# Altium project DSO.PrjPCB
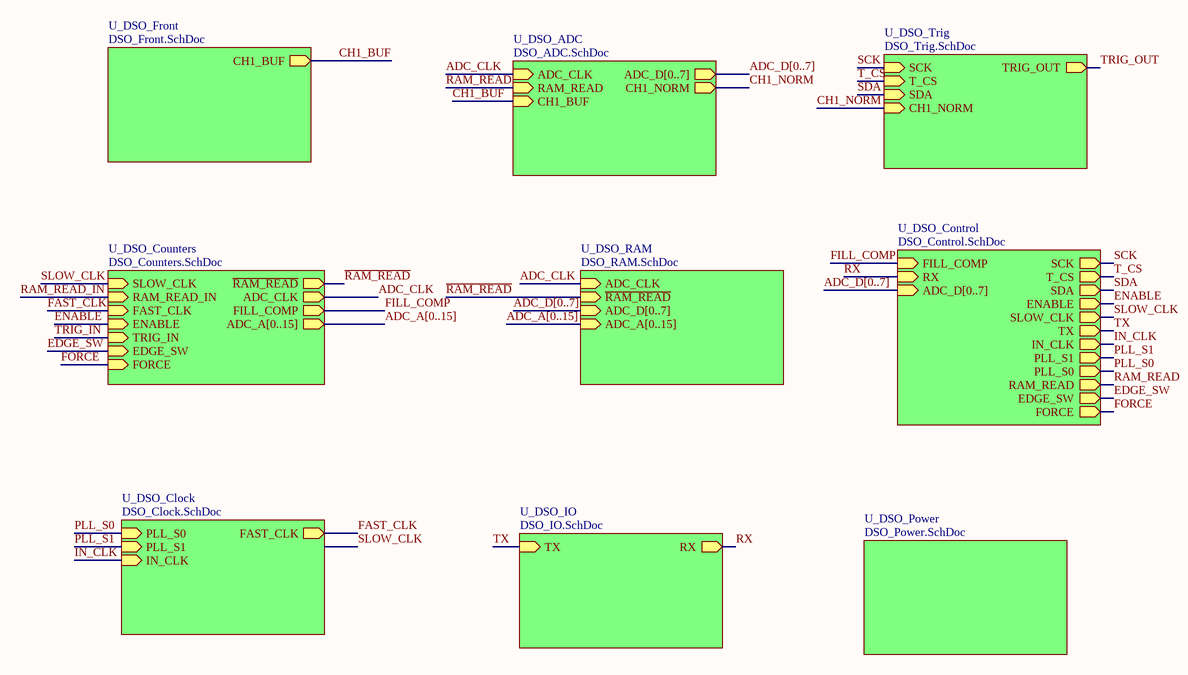
[diagram p0: DSO_Top.SchDoc]
11 sheets, 95 parts. Net scope: hierarchical (ports join the sheet entries above them; power ports are global).
Sheets:
  DSO_Top.SchDoc
    U_DSO_ADC = DSO_ADC.SchDoc
    U_DSO_Clock = DSO_Clock.SchDoc
    U_DSO_Control = DSO_Control.SchDoc
    U_DSO_Counters = DSO_Counters.SchDoc
      U_DSO_CPLD = DSO_CPLD.SchDoc
    U_DSO_Front = DSO_Front.SchDoc
    U_DSO_IO = DSO_IO.SchDoc
    U_DSO_Power = DSO_Power.SchDoc
    U_DSO_RAM = DSO_RAM.SchDoc
    U_DSO_Trig = DSO_Trig.SchDoc

## Sheet DSO_Top.SchDoc: Schematic_Name
size A4; CompanyName: University of Melbourne; Engineer: Your Name Here; DocumentNumber: 1; Revision: 0.1; SheetNumber: 1; SheetTotal: 1; Title_Project: Project_Title; StudentNo: Student No.

### Sub-sheets
U_DSO_ADC = DSO_ADC.SchDoc: ADC_CLK (in), ADC_D[0..7] (out), RAM_READ (in), CH1_BUF (in), CH1_NORM (out)
U_DSO_Clock = DSO_Clock.SchDoc: FAST_CLK (out), PLL_S0 (in), PLL_S1 (in), IN_CLK (in)
U_DSO_Control = DSO_Control.SchDoc: SCK (out), T_CS (out), SDA (out), ENABLE (out), FILL_COMP (in), SLOW_CLK (out), TX (out), RX (in), IN_CLK (out), PLL_S1 (out), PLL_S0 (out), RAM_READ (out), ADC_D[0..7] (in), EDGE_SW (out), FORCE (out)
U_DSO_Counters = DSO_Counters.SchDoc: SLOW_CLK (in), ~{RAM_READ} (out), ADC_CLK (out), RAM_READ_IN (in), FAST_CLK (in), FILL_COMP (out), ENABLE (in), TRIG_IN (in), EDGE_SW (in), FORCE (in), ADC_A[0..15] (out)
U_DSO_Front = DSO_Front.SchDoc: CH1_BUF (out)
U_DSO_IO = DSO_IO.SchDoc: TX (in), RX (out)
U_DSO_Power = DSO_Power.SchDoc: no entries
U_DSO_RAM = DSO_RAM.SchDoc: ADC_CLK (in), ~{RAM_READ} (in), ADC_D[0..7] (in), ADC_A[0..15] (in)
U_DSO_Trig = DSO_Trig.SchDoc: TRIG_OUT (out), SCK (in), T_CS (in), SDA (in), CH1_NORM (in)

### Nets
ADC_CLK: sheet U_DSO_ADC/ADC_CLK, sheet U_DSO_Counters/ADC_CLK, sheet U_DSO_RAM/ADC_CLK
CH1_BUF: sheet U_DSO_ADC/CH1_BUF, sheet U_DSO_Front/CH1_BUF
CH1_NORM: sheet U_DSO_ADC/CH1_NORM, sheet U_DSO_Trig/CH1_NORM
EDGE_SW: sheet U_DSO_Control/EDGE_SW, sheet U_DSO_Counters/EDGE_SW
ENABLE: sheet U_DSO_Control/ENABLE, sheet U_DSO_Counters/ENABLE
FAST_CLK: sheet U_DSO_Clock/FAST_CLK, sheet U_DSO_Counters/FAST_CLK
FILL_COMP: sheet U_DSO_Control/FILL_COMP, sheet U_DSO_Counters/FILL_COMP
FORCE: sheet U_DSO_Control/FORCE, sheet U_DSO_Counters/FORCE
IN_CLK: sheet U_DSO_Clock/IN_CLK, sheet U_DSO_Control/IN_CLK
PLL_S0: sheet U_DSO_Clock/PLL_S0, sheet U_DSO_Control/PLL_S0  [project net Clk_S0]
PLL_S1: sheet U_DSO_Clock/PLL_S1, sheet U_DSO_Control/PLL_S1  [project net Clk_S1]
~{RAM_READ}: sheet U_DSO_Counters/~{RAM_READ}, sheet U_DSO_RAM/~{RAM_READ}
RAM_READ: sheet U_DSO_ADC/RAM_READ, sheet U_DSO_Control/RAM_READ
RX: sheet U_DSO_Control/RX, sheet U_DSO_IO/RX
SCK: sheet U_DSO_Control/SCK, sheet U_DSO_Trig/SCK
SDA: sheet U_DSO_Control/SDA, sheet U_DSO_Trig/SDA
SLOW_CLK: sheet U_DSO_Control/SLOW_CLK, sheet U_DSO_Counters/SLOW_CLK
T_CS: sheet U_DSO_Control/T_CS, sheet U_DSO_Trig/T_CS
TX: sheet U_DSO_Control/TX, sheet U_DSO_IO/TX

### Buses and harness runs
bus ADC_A[0..15] = sheet U_DSO_Counters/ADC_A[0..15]
bus ADC_A[0..15] = sheet U_DSO_RAM/ADC_A[0..15]
bus ADC_D[0..7] = sheet U_DSO_ADC/ADC_D[0..7]
bus ADC_D[0..7] = sheet U_DSO_Control/ADC_D[0..7]
bus ADC_D[0..7] = sheet U_DSO_RAM/ADC_D[0..7]

## Sheet DSO_ADC.SchDoc: Schematic_Name
size A4; CompanyName: University of Melbourne; Engineer: Your Name Here; DocumentNumber: 1; Revision: 0.1; SheetNumber: 1; SheetTotal: 1; Title_Project: Project_Title; StudentNo: Student No.
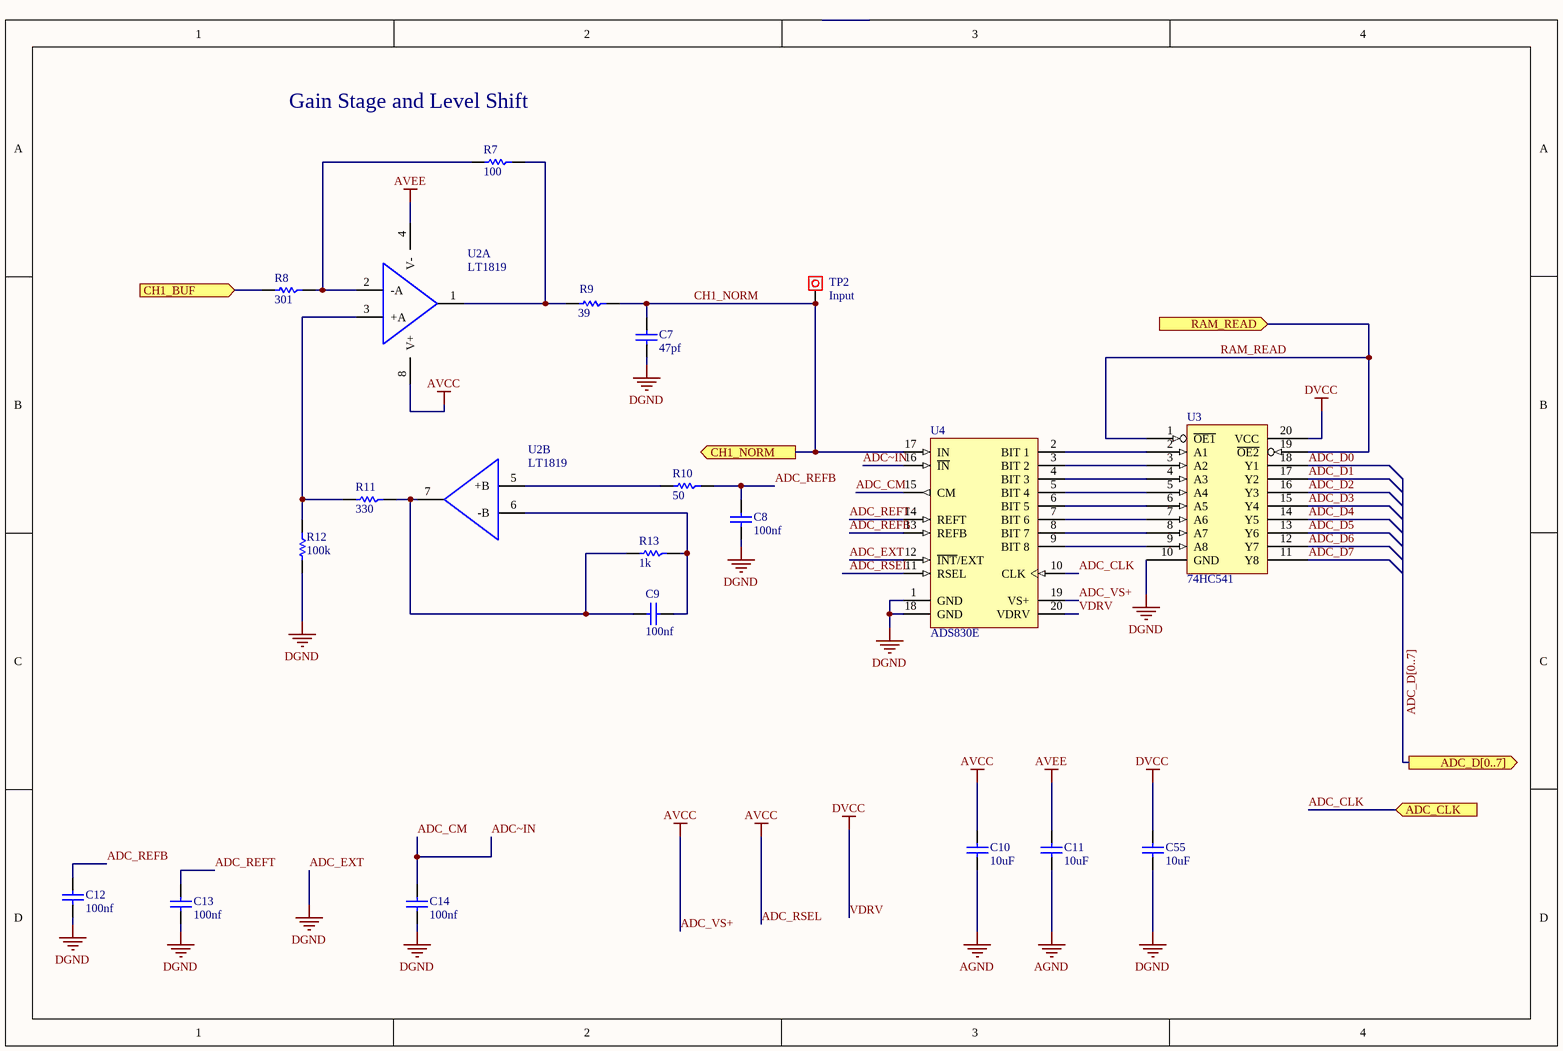
[diagram p1: DSO_ADC.SchDoc]

### Parts
(Parts that share a designator on the sheet are numbered #1, #2 ... from top to bottom, then left to right.)
C7#1  47pf  [0805C]
C8#1  100nf  [0805C]
C9#1  100nf  [0805C]
C10#1  10uF  [0805C]
C11#1  10uF  [0805C]
C12#1  100nf  [0805C]
C13#1  100nf  [0805C]
C14#1  100nf  [0805C]
C55  10uF  [0805C]
R7  100  [0805]
R8  301  [0805]
R9  39  [0805]
R10  50  [0805]
R11  330  [0805]
R12  100k  [0805]
R13  1k  [0805]
TP2  INPUT  [Testpoin]
U2  LT1819  [MSOP-8]  (parts A,B of 2)
U3#1  74HC541  [SOT163-1_N]
U4#1  ADS830E  [TI-DBQ20_L]

### Ports
ADC_CLK (in), ADC_D[0..7] (out), CH1_BUF (in), CH1_NORM (out), RAM_READ (in)

### Nets
ADC_EXT: C7#1.2 C8#1.1 C12#1.1 C13#1.1 C14#1.1 C55.2 R12.2 U3#1.10(GND) U4#1.1(GND) U4#1.12(~{INT}/EXT) U4#1.18(GND)  [also labelled DGND]
ADC_RSEL: C10#1.1 U2.8(V+) U4#1.11(RSEL) U4#1.19(VS+)  [also labelled ADC_VS+, AVCC]
AGND: C10#1.2 C11#1.2
AVEE: C11#1.1 U2.4(V-)
VDRV: C55.1 U3#1.20(VCC) U4#1.20(VDRV)  [also labelled DVCC]
ADC_CLK: U4#1.10(CLK) ; port ADC_CLK
ADC_CM: C14#1.2 U4#1.15(CM) U4#1.16(~{IN})  [also labelled ADC~IN]
ADC_D0: U3#1.18(Y1)
ADC_D1: U3#1.17(Y2)
ADC_D2: U3#1.16(Y3)
ADC_D3: U3#1.15(Y4)
ADC_D4: U3#1.14(Y5)
ADC_D5: U3#1.13(Y6)
ADC_D6: U3#1.12(Y7)
ADC_D7: U3#1.11(Y8)
ADC_REFB: C8#1.2 C12#1.2 R10.1 U4#1.13(REFB)
ADC_REFT: C13#1.2 U4#1.14(REFT)
CH1_BUF: R8.2 ; port CH1_BUF
CH1_NORM: C7#1.1 R9.1 TP2.1 U4#1.17(IN) ; port CH1_NORM
RAM_READ: U3#1.1(~{OE1}) U3#1.19(~{OE2}) ; port RAM_READ
NetC9#1_1: C9#1.1 R11.1 R13.2 U2.7(OUTB)
NetC9#1_2: C9#1.2 R13.1 U2.6(-B)
NetR7_1: R7.1 R9.2 U2.1(OUTA)
NetR7_2: R7.2 R8.1 U2.2(-A)
NetR10_2: R10.2 U2.5(+B)
NetR11_2: R11.2 R12.1 U2.3(+A)
NetU3#1_2: U3#1.2(A1) U4#1.2(BIT_1)
NetU3#1_3: U3#1.3(A2) U4#1.3(BIT_2)
NetU3#1_4: U3#1.4(A3) U4#1.4(BIT_3)
NetU3#1_5: U3#1.5(A4) U4#1.5(BIT_4)
NetU3#1_6: U3#1.6(A5) U4#1.6(BIT_5)
NetU3#1_7: U3#1.7(A6) U4#1.7(BIT_6)
NetU3#1_8: U3#1.8(A7) U4#1.8(BIT_7)
NetU3#1_9: U3#1.9(A8) U4#1.9(BIT_8)

### Buses and harness runs
bus ADC_D[0..7] = port ADC_D[0..7]

### Notes on the sheet
- (near R7) Gain Stage and Level Shift

### Library data of the parts
C7#1 C8#1 C9#1 C10#1 C11#1 C12#1 C13#1 C14#1 C55 = C: Capacitor; Reviewed by: RM - 2018/08/05; Revision: July-2002: Re-released for DXP Platform.; Supplier 1: *; Supplier Part Number 1: *
  C7#1: Value: 47pf
  C8#1 C9#1 C12#1 C13#1 C14#1: Value: 100nf
  C10#1 C11#1 C55: Value: 10uF
R7-R13 = R: Resistor; Reviewed by: RM - 2018/08/05; Supplier 1: *; Suppler Part Number 1: *
  R7: Value: 100
  R8: Value: 301
  R9: Value: 39
  R10: Value: 50
  R11: Value: 330
  R12: Value: 100k
  R13: Value: 1k
TP2 = Test Point: Pad; Value: Input
U2 = LT1819: OpAmp High Frequency Dual; Reviewed by: RM - 2018/08/05; Supplier 1: Digi-Key; Supplier Part Number 1: LT1819CMS8#PBF-ND
U3#1 = 74HC541: (ADV) Octal Buffer, Line Driver; Reviewed by: RM - 2018/08/05; Supplier 1: Digi-Key; Supplier Part Number 1: 296-1202-1-ND
U4#1 = ADS830E: 8-Bit, 60 MSPS ADC Single-Ended / Differential Input, Internal / External Reference and Programmble Input Range, -40 to 85 degC, 20-pin SOP (DBQ20), Green (RoHS & no Sb/Br); Reviewed by: RM - 2018/08/05; ComponentLink2URL: http://www.ti.com/general/docs/lit/getliterature.tsp?genericPartNumber=ADS830&fileType=pdf; ComponentLink2Description: Datasheet; ComponentLink1URL: http://www.ti.com/; ComponentLink3URL: http://www.ti.com/litv/pdf/mpds210a; ComponentLink3Description: Package Specification; ComponentLink1Description: Manufacturer URL; Supplier 1: Digi-Key; Supplier Part Number 1: ADS830E-ND

## Sheet DSO_Clock.SchDoc: Schematic_Name
size A4; CompanyName: University of Melbourne; Engineer: Your Name Here; DocumentNumber: 1; Revision: 0.1; SheetNumber: 1; SheetTotal: 1; Title_Project: Project_Title; StudentNo: Student No.
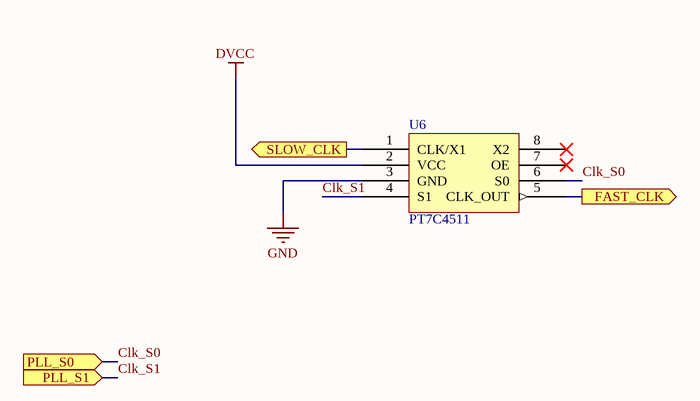
[diagram p2: DSO_Clock.SchDoc]

### Parts
(Parts that share a designator on the sheet are numbered #1, #2 ... from top to bottom, then left to right.)
U6#1  PT7C4511  [SOIC-8]

### Ports
FAST_CLK (out), PLL_S0 (in), PLL_S1 (in), SLOW_CLK (out)

### Nets
DVCC: U6#1.2(VCC)  [project net VDRV]
GND: U6#1.3(GND)
Clk_S0: U6#1.6(S0) ; port PLL_S0
Clk_S1: U6#1.4(S1) ; port PLL_S1
FAST_CLK: U6#1.5(CLK_OUT) ; port FAST_CLK
NetU6#1_1: U6#1.1(CLK/X1) ; port SLOW_CLK

Not connected (* = marked no-connect by the designer): U6#1 7(OE)* 8(X2)*

### Library data of the parts
U6#1 = PT7C4511: PLL Clock Multiplier; Reviewed by: RM - 2018/08/05; Supplier 1: Digi-Key; Supplier Part Number 1: PT7C4511WEXDICT-ND

## Sheet DSO_Control.SchDoc: Schematic_Name
size A4; CompanyName: University of Melbourne; Engineer: Your Name Here; DocumentNumber: 1; Revision: 0.1; SheetNumber: 1; SheetTotal: 1; Title_Project: Project_Title; StudentNo: Student No.
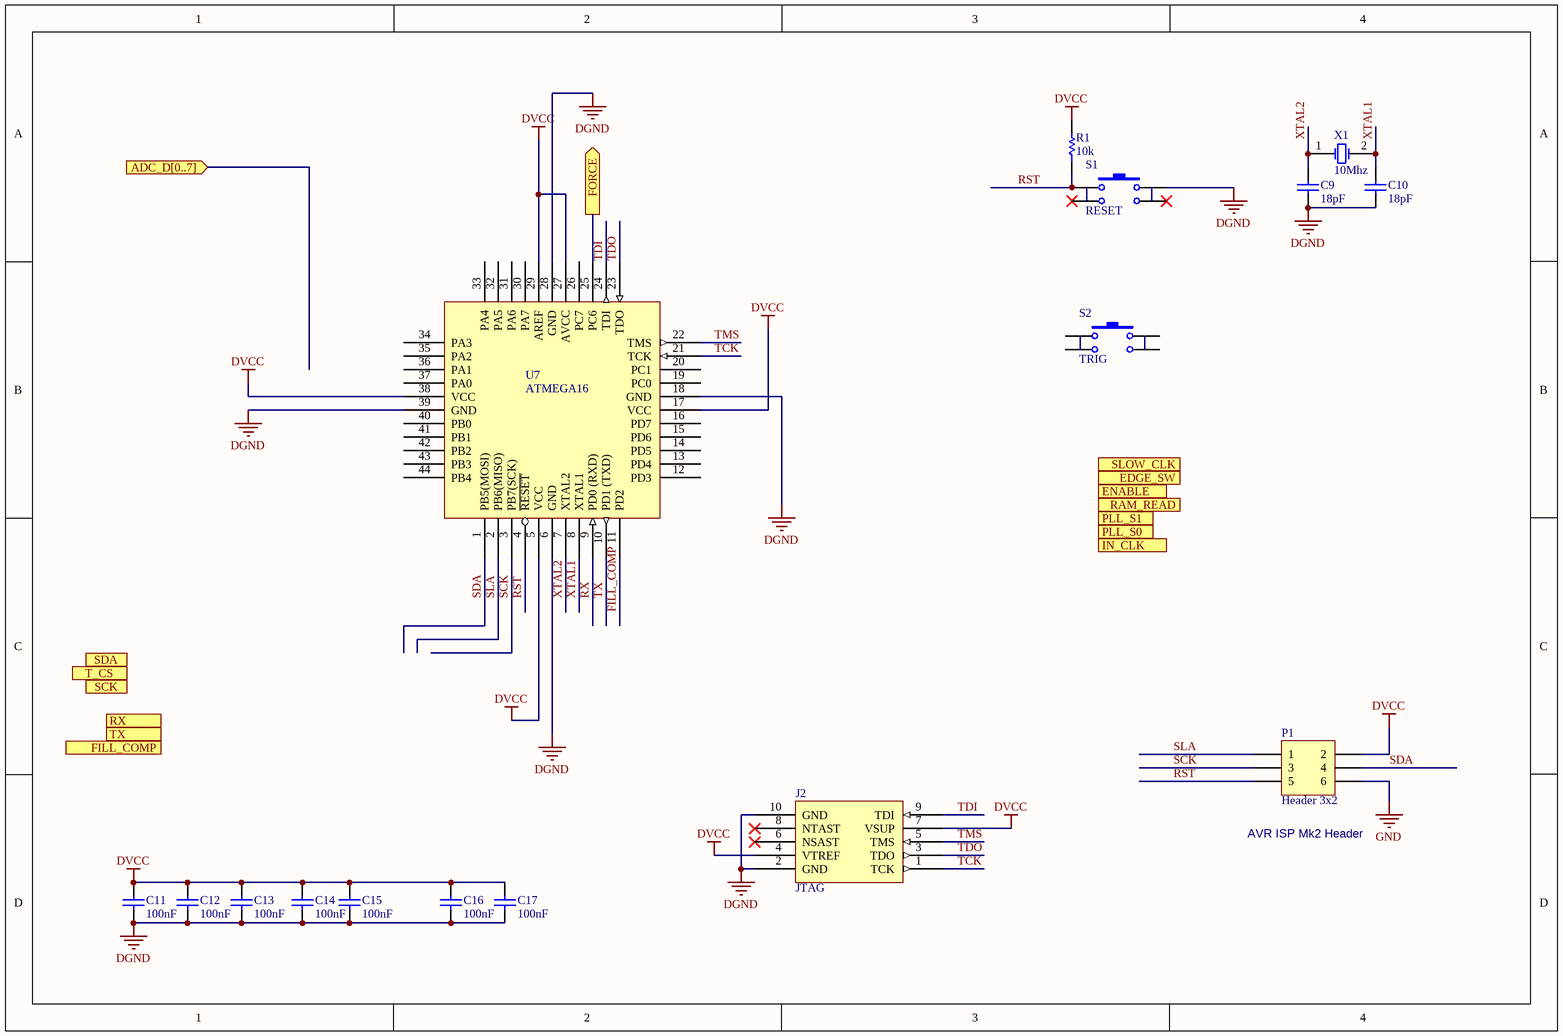
[diagram p3: DSO_Control.SchDoc]

### Parts
(Parts that share a designator on the sheet are numbered #1, #2 ... from top to bottom, then left to right.)
C9#2  18pF  [0805C]
C10#2  18pF  [0805C]
C11#2  100nF  [0805C]
C12#2  100nF  [0805C]
C13#2  100nF  [0805C]
C14#2  100nF  [0805C]
C15#1  100nF  [0805C]
C16#1  100nF  [0805C]
C17#1  100nF  [0805C]
J2  JTAG  [BOXEDVERT10]
P1  Header 3x2  [HDR3x2]
R1#1  10k  [0805]
S1  RESET  [SPST PB SWITCH SMD]
S2  TRIG  [SPST PB SWITCH SMD]
U7  ATMEGA16  [QFP-48]
X1  10Mhz  [XTAL_FLAT_SMD]

### Ports
ADC_D[0..7] (in), EDGE_SW (out), ENABLE (out), FILL_COMP (in), FORCE (out), IN_CLK (out), PLL_S0 (out), PLL_S1 (out), RAM_READ (out), RX (in), SCK (out), SDA (out), SLOW_CLK (out), T_CS (out), TX (out)

### Nets
DGND: C9#2.2 C10#2.2 C11#2.2 C12#2.2 C13#2.2 C14#2.2 C15#1.2 C16#1.2 C17#1.2 J2.2(GND) J2.10(GND) S1.2 U7.6(GND) U7.18(GND) U7.28(GND) U7.39(GND)  [project net ADC_EXT]
DVCC: C11#2.1 C12#2.1 C13#2.1 C14#2.1 C15#1.1 C16#1.1 C17#1.1 J2.4(VTREF) J2.7(VSUP) P1.2 R1#1.2 U7.5(VCC) U7.17(VCC) U7.27(AVCC) U7.29(AREF) U7.38(VCC)  [project net VDRV]
GND: P1.6
FILL_COMP: U7.11(PD2)
FORCE: U7.25(PC6) ; port FORCE
RST: P1.5 R1#1.1 S1.1 U7.4(~{RESET})
RX: U7.9(PD0_(RXD))
SCK: P1.3 U7.3(PB7(SCK))
SDA: P1.4 U7.1(PB5(MOSI))
SLA: P1.1 U7.2(PB6(MISO))
TCK: J2.1(TCK) U7.21(TCK)
TDI: J2.9(TDI) U7.24(TDI)
TDO: J2.3(TDO) U7.23(TDO)
TMS: J2.5(TMS) U7.22(TMS)
TX: U7.10(PD1_(TXD))
XTAL1: C10#2.1 U7.8(XTAL1) X1.2(OSC2)
XTAL2: C9#2.1 U7.7(XTAL2) X1.1(OSC1)

Not connected (* = marked no-connect by the designer): J2 6(NSAST)* 8(NTAST)*; S1 3* 4*; S2 1 2 3 4; U7 12(PD3) 13(PD4) 14(PD5) 15(PD6) 16(PD7) 19(PC0) 20(PC1) 26(PC7) 30(PA7) 31(PA6) 32(PA5) 33(PA4) 34(PA3) 35(PA2) 36(PA1) 37(PA0) 40(PB0) 41(PB1) 42(PB2) 43(PB3) 44(PB4)

### Notes on the sheet
- (near P1) AVR ISP Mk2 Header

### Library data of the parts
C9#2 C10#2 C11#2 C12#2 C13#2 C14#2 C15#1 C16#1 C17#1 = C: Capacitor; Reviewed by: RM - 2018/08/05; Revision: July-2002: Re-released for DXP Platform.; Supplier 1: *; Supplier Part Number 1: *
  C9#2 C10#2: Value: 18pF
  C11#2 C12#2 C13#2 C14#2 C15#1 C16#1 C17#1: Value: 100nF
J2 = JTAG_CON: Reviewed by: RM - 2018/08/05; Supplier 1: Digi-Key; Supplier Part Number 1: OR896-ND
P1 = Header 3x2: Header, 5-Pin; Reviewed by: RM - 2018/08/05; Supplier 1: Digi-Key; Supplier Part Number 1: 952-2121-ND
R1#1 = R: Resistor; Reviewed by: RM - 2018/08/05; Value: 10k; Supplier 1: *; Suppler Part Number 1: *
S1 S2 = SW_PB_1P1T4: Momentary Push Button Switch 1P 1T 2pins; Reviewed by: RM - 2018/08/05; Revision: July-2002: Re-released for DXP Platform.; Supplier 1: Digi-Key; Supplier Part Number 1: CKN9085CT-ND
U7 = ATMEGA16: ATMEGA16 Microcontroller; Reviewed by: RM - 2018/08/05; Supplier 1: Digi-Key; Supplier Part Number 1: ATMEGA16A-AU-ND
X1 = XTAL: Crystal Oscillator; Reviewed by: RM - 2018/08/05; Revision: July-2002: Re-released for DXP Platform.; Supplier 1: Digi-Key; Supplier Part Number 1: 887-1080-1-ND

## Sheet DSO_Counters.SchDoc: Schematic_Name
size A4; CompanyName: University of Melbourne; DrawnBy: Student_#; Engineer: Your Name Here; Organization: University of Melbourne; DocumentNumber: 5; Revision: 0.1; SheetNumber: 5; SheetTotal: 10; Title_Project: Project_Title
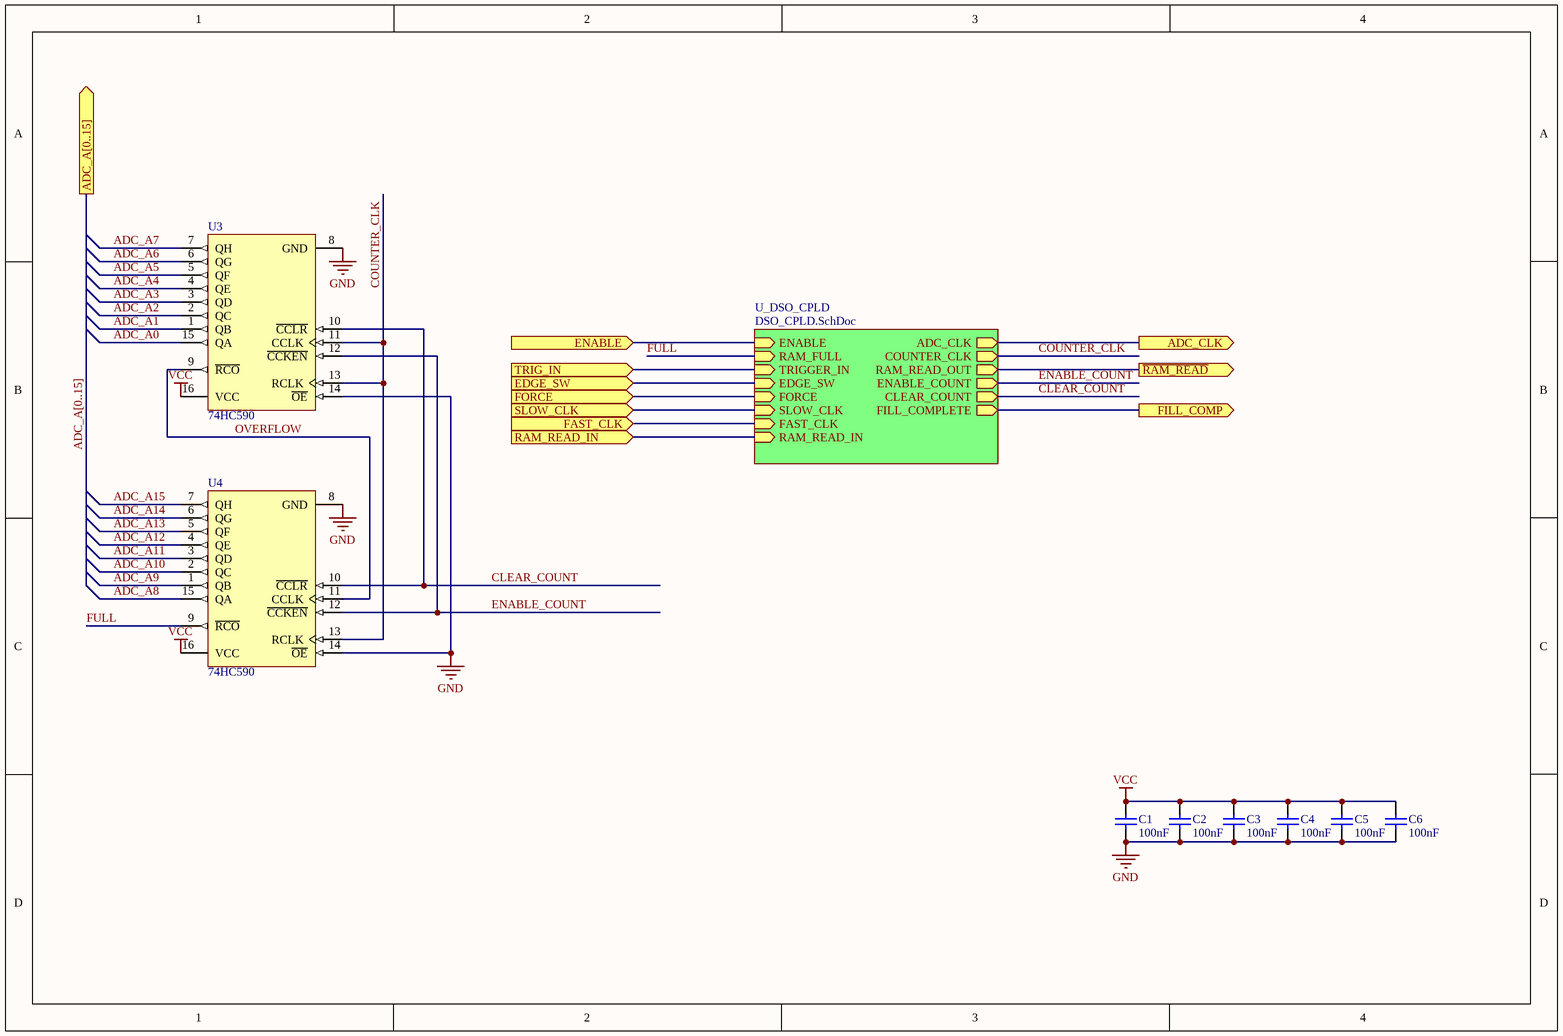
[diagram p4: DSO_Counters.SchDoc]

### Parts
(Parts that share a designator on the sheet are numbered #1, #2 ... from top to bottom, then left to right.)
C1#1  100nF  [0805C]
C2#1  100nF  [0805C]
C3#1  100nF  [0805C]
C4#1  100nF  [0805C]
C5#1  100nF  [0805C]
C6#1  100nF  [0805C]
U3#2  74HC590  [SOIC-16]
U4#2  74HC590  [SOIC-16]

### Sub-sheets
U_DSO_CPLD = DSO_CPLD.SchDoc: ENABLE (in), RAM_FULL (in), TRIGGER_IN (in), EDGE_SW (in), FORCE (in), SLOW_CLK (in), FAST_CLK (in), RAM_READ_IN (in), ADC_CLK (out), COUNTER_CLK (out), RAM_READ_OUT (out), ENABLE_COUNT (out), CLEAR_COUNT (out), FILL_COMPLETE (out)

### Ports
ADC_A[0..15] (out), ADC_CLK (out), EDGE_SW (in), ENABLE (in), FAST_CLK (in), FILL_COMP (out), FORCE (in), RAM_READ_IN (in), SLOW_CLK (in), TRIG_IN (in), ~{RAM_READ} (out)

### Nets
GND: C1#1.2 C2#1.2 C3#1.2 C4#1.2 C5#1.2 C6#1.2 U3#2.8(GND) U3#2.14(~{OE}) U4#2.8(GND) U4#2.14(~{OE})
VCC: C1#1.1 C2#1.1 C3#1.1 C4#1.1 C5#1.1 C6#1.1 U3#2.16(VCC) U4#2.16(VCC)
ADC_A0: U3#2.15(QA)
ADC_A1: U3#2.1(QB)
ADC_A2: U3#2.2(QC)
ADC_A3: U3#2.3(QD)
ADC_A4: U3#2.4(QE)
ADC_A5: U3#2.5(QF)
ADC_A6: U3#2.6(QG)
ADC_A7: U3#2.7(QH)
ADC_A8: U4#2.15(QA)
ADC_A9: U4#2.1(QB)
ADC_A10: U4#2.2(QC)
ADC_A11: U4#2.3(QD)
ADC_A12: U4#2.4(QE)
ADC_A13: U4#2.5(QF)
ADC_A14: U4#2.6(QG)
ADC_A15: U4#2.7(QH)
ADC_CLK: port ADC_CLK, sheet U_DSO_CPLD/ADC_CLK
CLEAR_COUNT: U3#2.10(~{CCLR}) U4#2.10(~{CCLR}) ; sheet U_DSO_CPLD/CLEAR_COUNT
COUNTER_CLK: U3#2.11(CCLK) U3#2.13(RCLK) U4#2.13(RCLK) ; sheet U_DSO_CPLD/COUNTER_CLK
EDGE_SW: port EDGE_SW, sheet U_DSO_CPLD/EDGE_SW
ENABLE: port ENABLE, sheet U_DSO_CPLD/ENABLE
ENABLE_COUNT: U3#2.12(~{CCKEN}) U4#2.12(~{CCKEN}) ; sheet U_DSO_CPLD/ENABLE_COUNT
FAST_CLK: port FAST_CLK, sheet U_DSO_CPLD/FAST_CLK
FILL_COMP: port FILL_COMP, sheet U_DSO_CPLD/FILL_COMPLETE
FORCE: port FORCE, sheet U_DSO_CPLD/FORCE
FULL: U4#2.9(~{RCO}) ; sheet U_DSO_CPLD/RAM_FULL
OVERFLOW: U3#2.9(~{RCO}) U4#2.11(CCLK)
~{RAM_READ}: port ~{RAM_READ}, sheet U_DSO_CPLD/RAM_READ_OUT
RAM_READ_IN: port RAM_READ_IN, sheet U_DSO_CPLD/RAM_READ_IN
SLOW_CLK: port SLOW_CLK, sheet U_DSO_CPLD/SLOW_CLK
TRIG_IN: port TRIG_IN, sheet U_DSO_CPLD/TRIGGER_IN

### Buses and harness runs
bus ADC_A[0..15] = port ADC_A[0..15]

### Library data of the parts
C1#1 C2#1 C3#1 C4#1 C5#1 C6#1 = C: Capacitor; Reviewed by: RM - 2018/08/05; Revision: July-2002: Re-released for DXP Platform.; Value: 100nF; Supplier 1: *; Supplier Part Number 1: *
U3#2 U4#2 = 74HC590: 8-Bit Binary Counter Register; Reviewed by: RM - 2018/08/05; ComponentLink1Description: Manufacturer Link; ComponentLink1URL: http://www.st.com/; ComponentLink2Description: Datasheet; ComponentLink2URL: http://www.st.com/stonline/products/literature/ds/1986/m74hc590.pdf; Supplier 1: Digi-Key; Supplier Part Number 1: 296-17132-1-ND

## Sheet DSO_CPLD.SchDoc
size A4
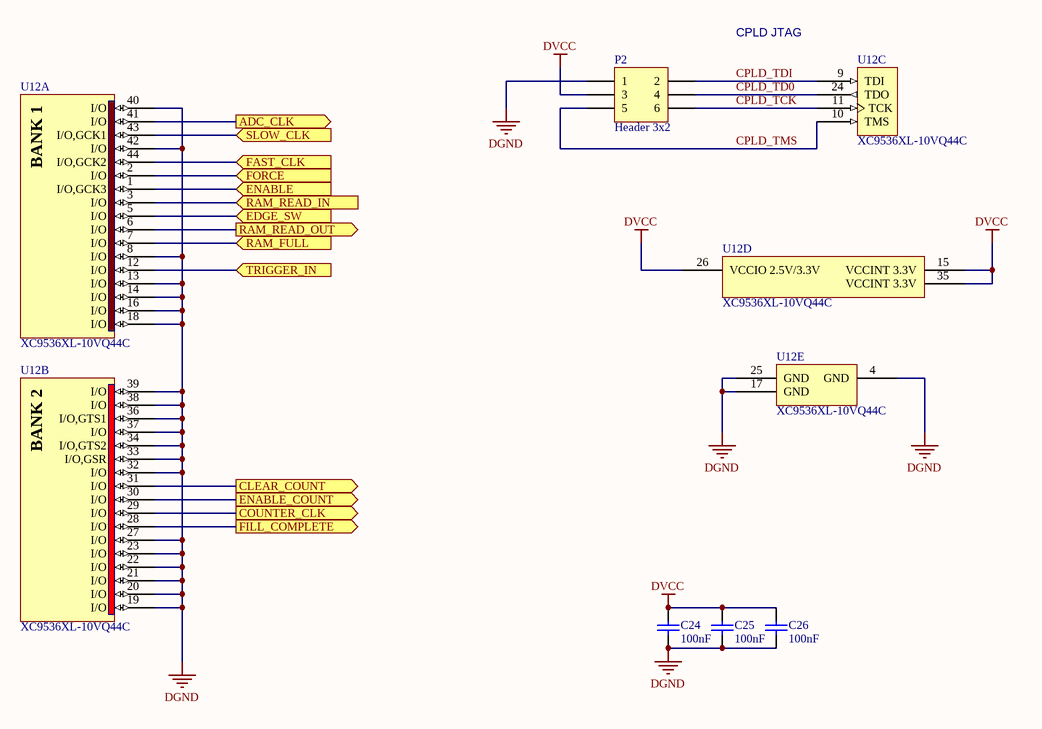
[diagram p5: DSO_CPLD.SchDoc]

### Parts
C24  100nF  [0805C]
C25  100nF  [0805C]
C26  100nF  [0805C]
P2  Header 3x2  [HDR3x2]
U12  XC9536XL-10VQ44C  [VQ44_L]  (parts A,B,C,D,E of 5)

### Ports
ADC_CLK (out), CLEAR_COUNT (out), COUNTER_CLK (out), EDGE_SW (in), ENABLE (in), ENABLE_COUNT (out), FAST_CLK (in), FILL_COMPLETE (out), FORCE (in), RAM_FULL (in), RAM_READ_IN (in), RAM_READ_OUT (out), SLOW_CLK (in), TRIGGER_IN (in)

### Nets
DGND: C24.2 C25.2 C26.2 P2.1 U12.4(GND) U12.8(I/O) U12.13(I/O) U12.14(I/O) U12.16(I/O) U12.17(GND) U12.18(I/O) U12.19(I/O) U12.20(I/O) U12.21(I/O) U12.22(I/O) U12.23(I/O) U12.25(GND) U12.27(I/O) U12.32(I/O) U12.33(I/O,GSR) U12.34(I/O,GTS2) U12.36(I/O,GTS1) U12.37(I/O) U12.38(I/O) U12.39(I/O) U12.40(I/O) U12.42(I/O)  [project net ADC_EXT]
DVCC: C24.1 C25.1 C26.1 P2.3 U12.15(VCCINT_3.3V) U12.26(VCCIO_2.5V/3.3V) U12.35(VCCINT_3.3V)  [project net VDRV]
ADC_CLK: U12.41(I/O) ; port ADC_CLK
CLEAR_COUNT: U12.31(I/O) ; port CLEAR_COUNT
COUNTER_CLK: U12.29(I/O) ; port COUNTER_CLK
CPLD_TCK: P2.6 U12.11(TCK)
CPLD_TD0: P2.4 U12.24(TDO)
CPLD_TDI: P2.2 U12.9(TDI)
CPLD_TMS: P2.5 U12.10(TMS)
EDGE_SW: U12.5(I/O) ; port EDGE_SW
ENABLE: U12.1(I/O,GCK3) ; port ENABLE
ENABLE_COUNT: U12.30(I/O) ; port ENABLE_COUNT
FAST_CLK: U12.44(I/O,GCK2) ; port FAST_CLK
FILL_COMP: U12.28(I/O) ; port FILL_COMPLETE
FORCE: U12.2(I/O) ; port FORCE
FULL: U12.7(I/O) ; port RAM_FULL
~{RAM_READ}: U12.6(I/O) ; port RAM_READ_OUT
RAM_READ_IN: U12.3(I/O) ; port RAM_READ_IN
SLOW_CLK: U12.43(I/O,GCK1) ; port SLOW_CLK
TRIG_IN: U12.12(I/O) ; port TRIGGER_IN

### Notes on the sheet
- CPLD JTAG
- (in symbol XC9536XL-10VQG44C, part A) BANK 1
- (in symbol XC9536XL-10VQG44C, part B) BANK 2

### Library data of the parts
C24-C26 = C: Capacitor; Reviewed by: RM - 2018/08/05; Revision: July-2002: Re-released for DXP Platform.; Value: 100nF; Supplier 1: *; Supplier Part Number 1: *
P2 = Header 3x2: as P1 on sheet DSO_Control; Supplier 1: Digi-Key; Supplier Part Number 1: 952-2121-ND
U12 = XC9536XL-10VQG44C: FastFLASH XC900XL, 3.3V High-Performance 36 Macrocell CPLD, 34 User I/Os, 44-Pin VQFP, Speed Grade 10, Commercial Grade; Reviewed by: RM - 2018/08/05; Supplier 1: Digi-Key; Supplier Part Number 1: 122-1385-ND

## Sheet DSO_Front.SchDoc: Schematic_Name
size A4; CompanyName: University of Melbourne; Engineer: Your Name Here; DocumentNumber: 1; Revision: 0.1; SheetNumber: 1; SheetTotal: 1; Title_Project: Project_Title; StudentNo: Student No.
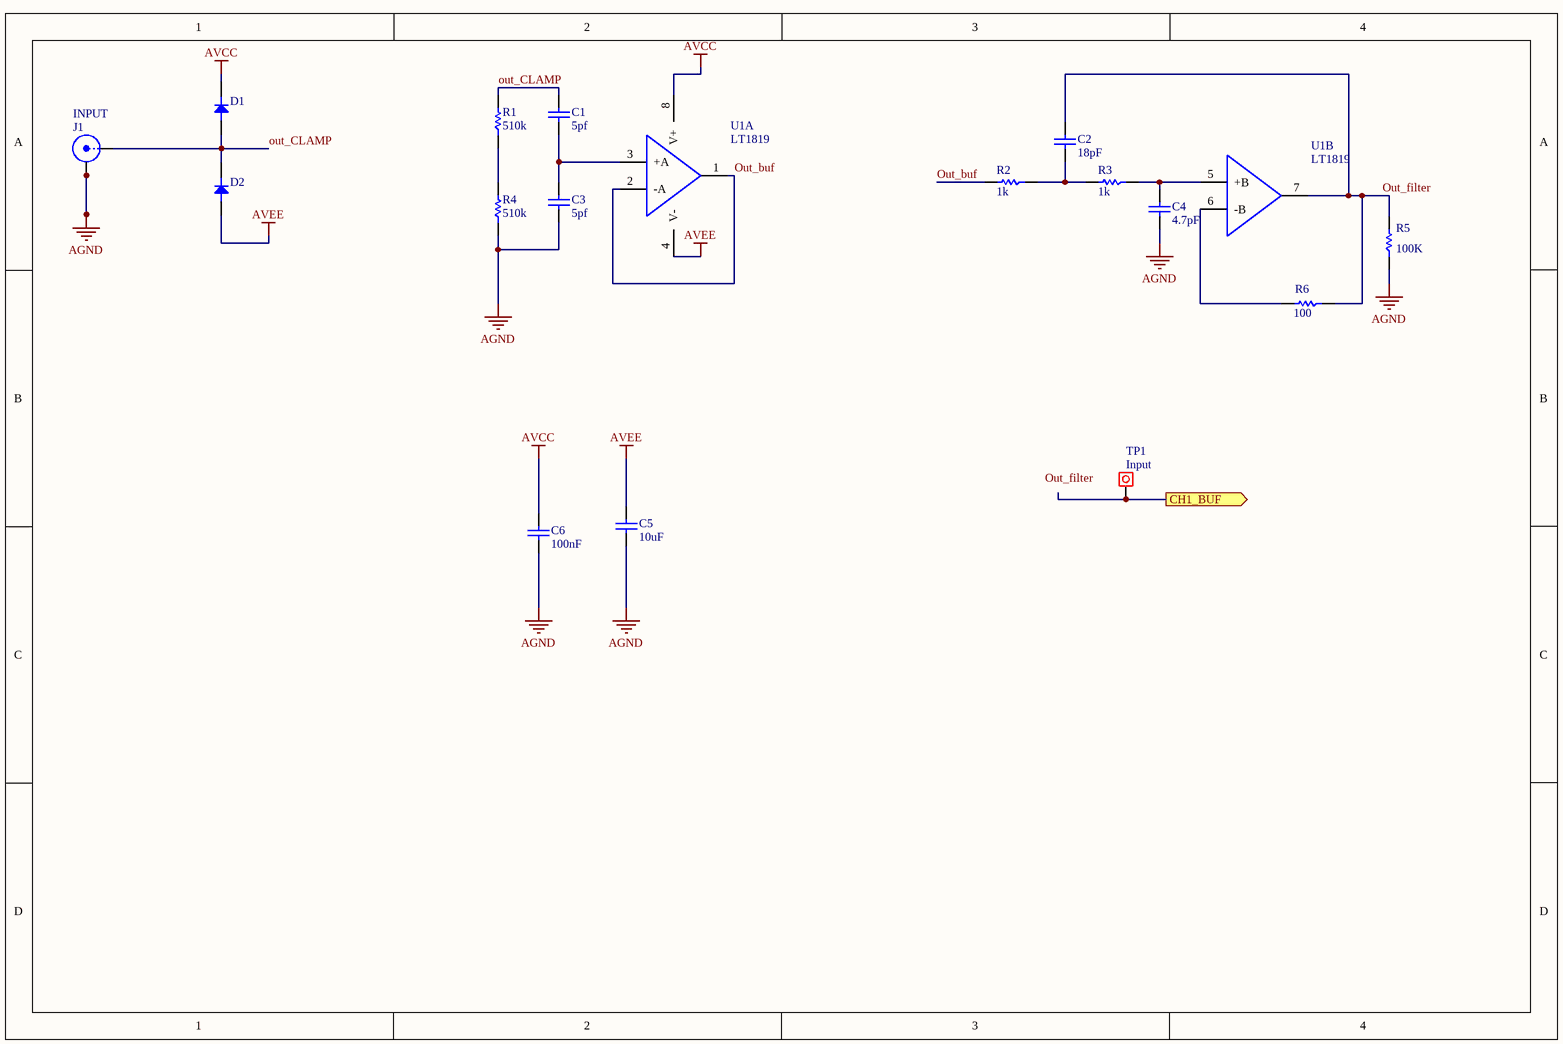
[diagram p6: DSO_Front.SchDoc]

### Parts
(Parts that share a designator on the sheet are numbered #1, #2 ... from top to bottom, then left to right.)
C1#2  5pf  [0805C]
C2#2  18pF  [0805C]
C3#2  5pf  [0805C]
C4#2  4.7pF  [0805C]
C5#2  10uF  [0805C]
C6#2  100nF  [0805C]
D1#1  Diode  [SOD-123]  (value not drawn)
D2#1  Diode  [SOD-123]  (value not drawn)
J1  INPUT  [BNC_VERT]
R1#2  510k  [0805]
R2#1  1k  [0805]
R3#1  1k  [0805]
R4  510k  [0805]
R5  100K  [0805]
R6  100  [0805]
TP1  INPUT  [Testpoin]
U1  LT1819  [SOIC-8]  (parts A,B of 2)

### Ports
CH1_BUF (out)

### Nets
AGND: C3#2.2 C4#2.2 C5#2.2 C6#2.2 J1.2(Y) J1.3(Y) J1.4(Y) J1.5(Y) R4.1 R5.1
AVCC: C6#2.1 D1#1.K U1.8(V+)  [project net ADC_RSEL]
AVEE: C5#2.1 D2#1.A U1.4(V-)
CH1_BUF: TP1.1 ; port CH1_BUF
Out_buf: R2#1.2 U1.1(OUTA) U1.2(-A)
out_CLAMP: C1#2.1 D1#1.A D2#1.K J1.1(X) R1#2.2
Out_filter: C2#2.1 R5.2 R6.1 U1.7(OUTB)
NetC1#2_2: C1#2.2 C3#2.1 U1.3(+A)
NetC2#2_2: C2#2.2 R2#1.1 R3#1.2
NetC4#2_1: C4#2.1 R3#1.1 U1.5(+B)
NetR1#2_1: R1#2.1 R4.2
NetR6_2: R6.2 U1.6(-B)

### Notes on the sheet
- Labels drawn without touching a wire or pin: Out_filter

### Library data of the parts
C1#2 C2#2 C3#2 C4#2 C5#2 C6#2 = C: Capacitor; Reviewed by: RM - 2018/08/05; Revision: July-2002: Re-released for DXP Platform.; Supplier 1: *; Supplier Part Number 1: *
  C1#2 C3#2: Value: 5pf
  C2#2: Value: 18pF
  C4#2: Value: 4.7pF
  C5#2: Value: 10uF
  C6#2: Value: 100nF
D1#1 D2#1 = D: Reviewed by: RM - 2018/08/05; Revision: July-2002: Re-released for DXP Platform.; Supplier 1: *; Supplier Part Number 1: *
J1 = BNC: BNC Straight; Reviewed by: RM - 2018/08/05; Supplier Part Number 1: A97581-ND; Supplier 1: Digi-Key
R1#2 R2#1 R3#1 R4-R6 = R: Resistor; Reviewed by: RM - 2018/08/05; Supplier 1: *; Suppler Part Number 1: *
  R1#2 R4: Value: 510k
  R2#1 R3#1: Value: 1k
  R5: Value: 100K
  R6: Value: 100
TP1 = Test Point: Pad; Value: Input
U1 = LT1819: as U2 on sheet DSO_ADC; Supplier 1: Digi-Key; Supplier Part Number 1: LT1819CMS8#PBF-ND

## Sheet DSO_IO.SchDoc: Schematic_Name
size A4; CompanyName: University of Melbourne; Engineer: Your Name Here; DocumentNumber: 1; Revision: 0.1; SheetNumber: 1; SheetTotal: 1; Title_Project: Project_Title; StudentNo: Student No.
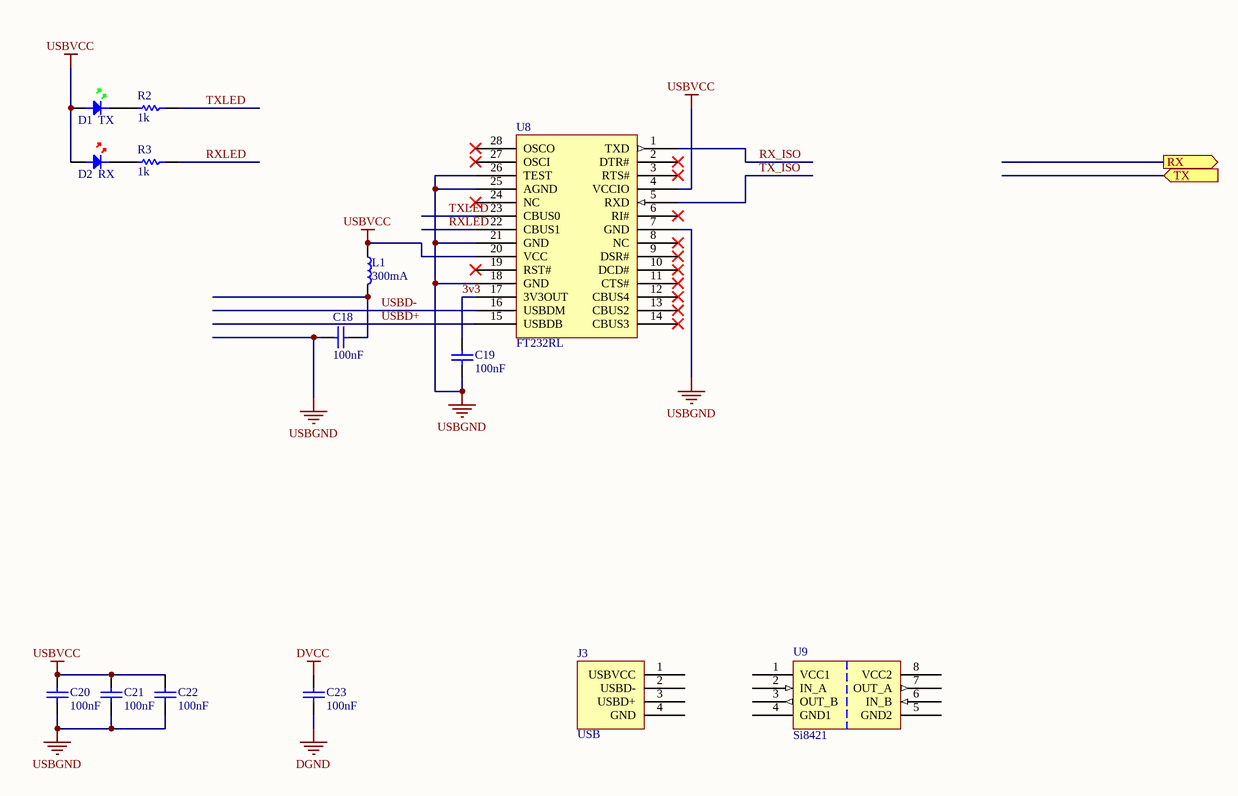
[diagram p7: DSO_IO.SchDoc]

### Parts
(Parts that share a designator on the sheet are numbered #1, #2 ... from top to bottom, then left to right.)
C18  100nF  [0805C]
C19  100nF  [0805C]
C20  100nF  [0805C]
C21  100nF  [0805C]
C22  100nF  [0805C]
C23  100nF  [0805C]
D1#2  TX  [0805D-GREEN]
D2#2  RX  [0805D-RED]
J3  USB  [USBPLUG]
L1  300mA  [0805]
R2#2  1k  [0805]
R3#2  1k  [0805]
U8  FT232RL  [SSOP-28]
U9  Si8421  [SOIC-8]

### Ports
RX (out), TX (in)

### Nets
DGND: C23.2  [project net ADC_EXT]
DVCC: C23.1  [project net VDRV]
USBGND: C18.2 C19.2 C20.2 C21.2 C22.2 U8.7(GND) U8.18(GND) U8.21(GND) U8.25(AGND) U8.26(TEST)
USBVCC: C20.1 C21.1 C22.1 D1#2.A D2#2.A L1.1 U8.4(VCCIO) U8.20(VCC)
3v3: C19.1 U8.17(3V3OUT)
RX_ISO: U8.1(TXD)
RXLED: R3#2.1 U8.22(CBUS1)
TX_ISO: U8.5(RXD)
TXLED: R2#2.1 U8.23(CBUS0)
USBD+: U8.15(USBDB)
USBD-: U8.16(USBDM)
NetC18_1: C18.1 L1.2
NetD1#2_K: D1#2.K R2#2.2
NetD2#2_K: D2#2.K R3#2.2

Not connected (* = marked no-connect by the designer): J3 1(USBVCC) 2(USBD-) 3(USBD+) 4(GND); U8 2(DTR#)* 3(RTS#)* 6(RI#)* 8(NC)* 9(DSR#)* 10(DCD#)* 11(CTS#)* 12(CBUS4)* 13(CBUS2)* 14(CBUS3)* 19(RST#)* 24(NC)* 27(OSCI)* 28(OSCO)*; U9 1(VCC1) 2(IN_A) 3(OUT_B) 4(GND1) 5(GND2) 6(IN_B) 7(OUT_A) 8(VCC2)

### Library data of the parts
C18-C23 = C: Capacitor; Reviewed by: RM - 2018/08/05; Revision: July-2002: Re-released for DXP Platform.; Value: 100nF; Supplier 1: *; Supplier Part Number 1: *
D1#2 = LED GREEN: Light Emitting Diode; Reviewed by: RM - 2018/08/05; Revision: July-2002: Re-released for DXP Platform.; Supplier 1: Digi-Key; Supplier Part Number 1: 160-1423-1-ND
D2#2 = LED RED: Light Emitting Diode; Reviewed by: RM - 2018/08/05; Revision: July-2002: Re-released for DXP Platform.; Supplier 1: Digi-Key; Supplier Part Number 1: 475-1415-1-ND
J3 = USBPLUG: USB B Type Connector; Reviewed by: RM - 2018/08/05; Supplier 1: Digi-Key; Supplier Part Number 1: 609-1039-ND
L1 = I: Inductor; Reviewed by: RM - 2018/08/05; Value: 300mA; Supplier 1: *; Supplier Part Number 1: *
R2#2 R3#2 = R: Resistor; Reviewed by: RM - 2018/08/05; Value: 1k; Supplier 1: *; Suppler Part Number 1: *
U8 = FT232RL: USB to Serial bridge; Reviewed by: RM - 2018/08/05; Supplier 1: Digi-Key; Supplier Part Number 1: 768-1007-1-ND
U9 = Si8421: Dual Channel Digital Isolator Both Ways; Reviewed by: RM - 2018/08/05; Supplier 1: Digi-Key; Supplier Part Number 1: 336-1755-5-ND

## Sheet DSO_Power.SchDoc: Schematic_Name
size A4; CompanyName: University of Melbourne; Engineer: Your Name Here; DocumentNumber: 1; Revision: 0.1; SheetNumber: 1; SheetTotal: 1; Title_Project: Project_Title; StudentNo: Student No.
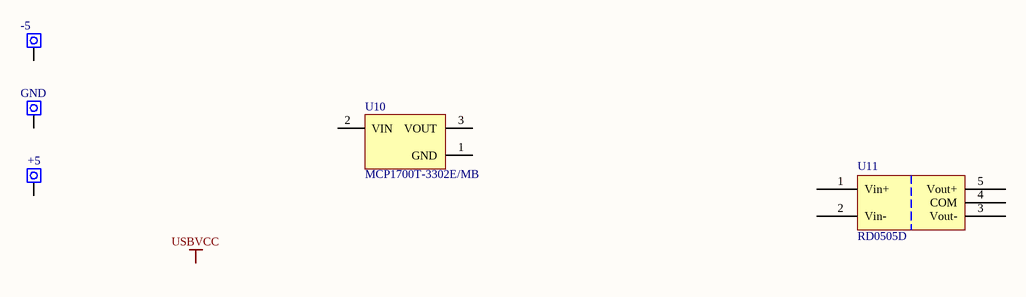
[diagram p8: DSO_Power.SchDoc]

### Parts
TP4  -5  [PIN 1.8mm]
TP5  GND  [PIN 1.8mm]
TP6  +5  [PIN 1.8mm]
U10  MCP1700T-3302E/MB  [SOT89]
U11  RD0505D  [SIP_NMG]

### Nets

Not connected (* = marked no-connect by the designer): TP4 1; TP5 1; TP6 1; U10 1(GND) 2(VIN) 3(VOUT); U11 1(Vin+) 2(Vin-) 3(Vout-) 4(COM) 5(Vout+)

### Notes on the sheet
- Labels drawn without touching a wire or pin: USBVCC

### Library data of the parts
TP4-TP6 = WIRE: Pad
U10 = MCP1700T: Low Quiescent Current LDO, 3-Pin SOT-89, Extended Temperature, Tape and Reel; Reviewed by: RM - 2018/08/05; Supplier 1: Digi-Key; Supplier Part Number 1: MCP1700T3302EMBCT-ND
U11 = RD0505D: (ADV) DC to DC converter 5V in +-5V out; Reviewed by: RM - 2018/08/05; Supplier Part Number 1: 945-1136-ND; Supplier 1: Digi-Key

## Sheet DSO_RAM.SchDoc: Schematic_Name
size A4; CompanyName: University of Melbourne; Engineer: Your Name Here; DocumentNumber: 1; Revision: 0.1; SheetNumber: 1; SheetTotal: 1; Title_Project: Project_Title; StudentNo: Student No.
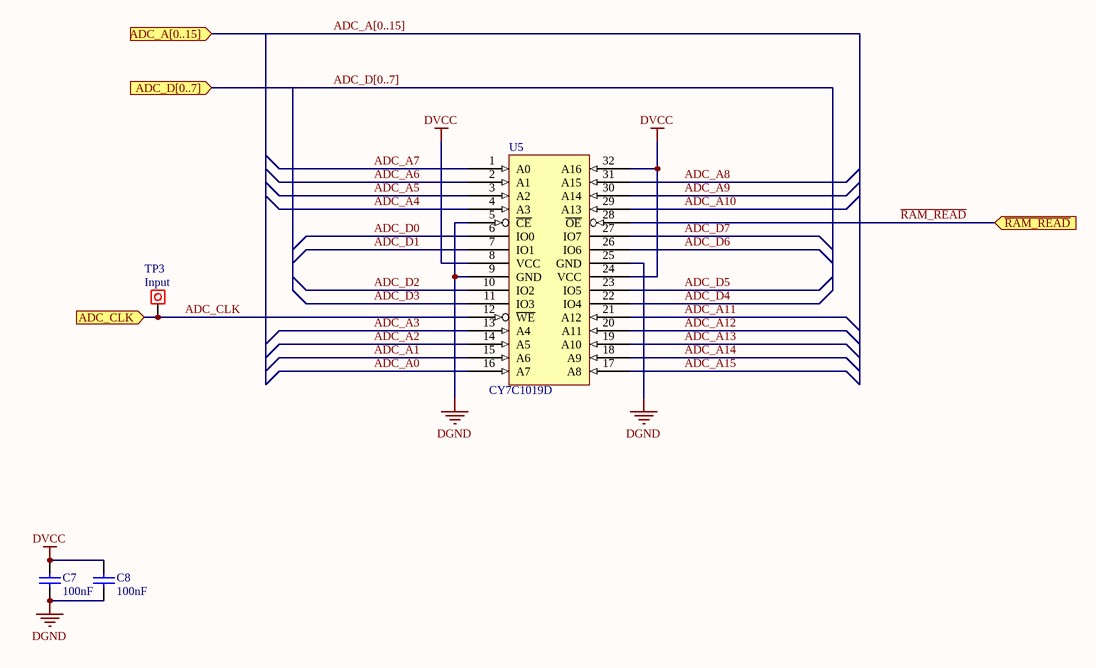
[diagram p9: DSO_RAM.SchDoc]

### Parts
(Parts that share a designator on the sheet are numbered #1, #2 ... from top to bottom, then left to right.)
C7#2  100nF  [0805C]
C8#2  100nF  [0805C]
TP3  INPUT  [Testpoin]
U5#1  CY7C1019D  [TSOP-32]

### Ports
ADC_A[0..15] (in), ADC_CLK (in), ADC_D[0..7] (in), ~{RAM_READ} (in)

### Nets
DGND: C7#2.2 C8#2.2 U5#1.5(~{CE}) U5#1.9(GND) U5#1.25(GND)  [project net ADC_EXT]
DVCC: C7#2.1 C8#2.1 U5#1.8(VCC) U5#1.24(VCC) U5#1.32(A16)  [project net VDRV]
ADC_A0: U5#1.16(A7)
ADC_A1: U5#1.15(A6)
ADC_A2: U5#1.14(A5)
ADC_A3: U5#1.13(A4)
ADC_A4: U5#1.4(A3)
ADC_A5: U5#1.3(A2)
ADC_A6: U5#1.2(A1)
ADC_A7: U5#1.1(A0)
ADC_A8: U5#1.31(A15)
ADC_A9: U5#1.30(A14)
ADC_A10: U5#1.29(A13)
ADC_A11: U5#1.21(A12)
ADC_A12: U5#1.20(A11)
ADC_A13: U5#1.19(A10)
ADC_A14: U5#1.18(A9)
ADC_A15: U5#1.17(A8)
ADC_CLK: TP3.1 U5#1.12(~{WE}) ; port ADC_CLK
ADC_D0: U5#1.6(IO0)
ADC_D1: U5#1.7(IO1)
ADC_D2: U5#1.10(IO2)
ADC_D3: U5#1.11(IO3)
ADC_D4: U5#1.22(IO4)
ADC_D5: U5#1.23(IO5)
ADC_D6: U5#1.26(IO6)
ADC_D7: U5#1.27(IO7)
~{RAM_READ}: U5#1.28(~{OE}) ; port ~{RAM_READ}

### Buses and harness runs
bus ADC_A[0..15] = port ADC_A[0..15]
bus ADC_D[0..7] = port ADC_D[0..7]

### Library data of the parts
C7#2 C8#2 = C: Capacitor; Reviewed by: RM - 2018/08/05; Revision: July-2002: Re-released for DXP Platform.; Value: 100nF; Supplier 1: *; Supplier Part Number 1: *
TP3 = Test Point: Pad; Value: Input
U5#1 = CY7C1019D: SRAM 128k x 8; Reviewed by: RM - 2018/08/05; Supplier 1: Digi-Key; Supplier Part Number 1: 428-1967-ND

## Sheet DSO_Trig.SchDoc: Schematic_Name
size A4; CompanyName: University of Melbourne; Engineer: Your Name Here; DocumentNumber: 1; Revision: 0.1; SheetNumber: 1; SheetTotal: 1; Title_Project: Project_Title; StudentNo: Student No.
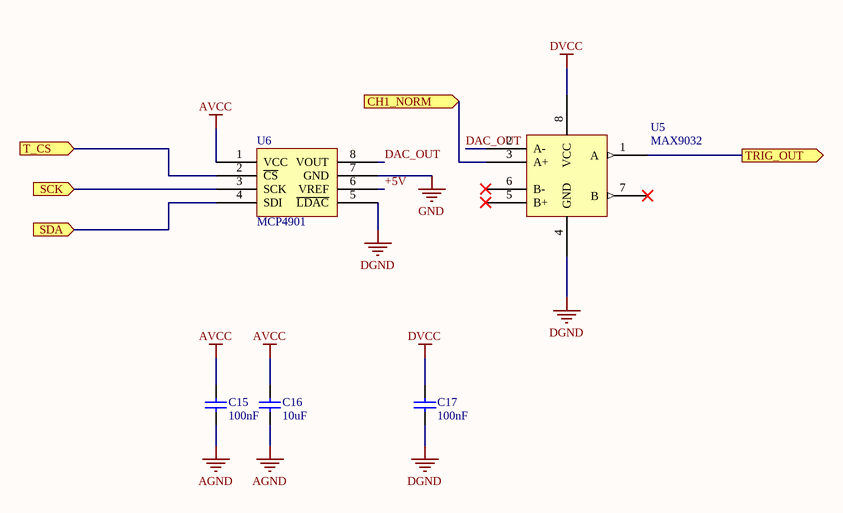
[diagram p10: DSO_Trig.SchDoc]

### Parts
(Parts that share a designator on the sheet are numbered #1, #2 ... from top to bottom, then left to right.)
C15#2  100nF  [0805C]
C16#2  10uF  [0805C]
C17#2  100nF  [0805C]
U5#2  MAX9032  [SOIC-8]
U6#2  MCP4901  [SOIC-8]

### Ports
CH1_NORM (in), SCK (in), SDA (in), T_CS (in), TRIG_OUT (out)

### Nets
AGND: C15#2.2 C16#2.2
AVCC: C15#2.1 C16#2.1 U6#2.1(VCC)  [project net ADC_RSEL]
DGND: C17#2.2 U5#2.4(GND) U6#2.5(~{LDAC})  [project net ADC_EXT]
DVCC: C17#2.1 U5#2.8(VCC)  [project net VDRV]
GND: U6#2.7(GND)
+5V: U6#2.6(VREF)
CH1_NORM: U5#2.3(A+) ; port CH1_NORM
DAC_OUT: U5#2.2(A-) U6#2.8(VOUT)
SCK: U6#2.3(SCK) ; port SCK
SDA: U6#2.4(SDI) ; port SDA
T_CS: U6#2.2(~{CS}) ; port T_CS
TRIG_OUT: U5#2.1(A) ; port TRIG_OUT

Not connected (* = marked no-connect by the designer): U5#2 5(B+)* 6(B-)* 7(B)*

### Library data of the parts
C15#2 C16#2 C17#2 = C: Capacitor; Reviewed by: RM - 2018/08/05; Revision: July-2002: Re-released for DXP Platform.; Supplier 1: *; Supplier Part Number 1: *
  C15#2 C17#2: Value: 100nF
  C16#2: Value: 10uF
U5#2 = MAX9032: Dual Comparator; Reviewed by: RM - 2018/08/05; Supplier 1: Digi-Key; Supplier Part Number 1: MAX9032ASA-ND
U6#2 = MCP4901: DAC 8bit SPI; Reviewed by: RM - 2018/08/05; Supplier 1: Digi-Key; Supplier Part Number 1: MCP4901-E/SN-ND

## Nets that join several sheets
ADC_EXT: DSO_ADC (11 pins), DSO_Control (16 pins), DSO_CPLD (27 pins), DSO_IO (C23.2), DSO_RAM (5 pins), DSO_Trig (C17#2.2 U5#2.4 U6#2.5)
ADC_RSEL: DSO_ADC (C10#1.1 U2.8 U4#1.11 U4#1.19), DSO_Front (C6#2.1 D1#1.K U1.8), DSO_Trig (C15#2.1 C16#2.1 U6#2.1)
AGND: DSO_ADC (C10#1.2 C11#1.2), DSO_Front (10 pins), DSO_Trig (C15#2.2 C16#2.2)
AVEE: DSO_ADC (C11#1.1 U2.4), DSO_Front (C5#2.1 D2#1.A U1.4)
GND: DSO_Clock (U6#1.3), DSO_Control (P1.6), DSO_Counters (10 pins), DSO_Trig (U6#2.7)
VDRV: DSO_ADC (C55.1 U3#1.20 U4#1.20), DSO_Clock (U6#1.2), DSO_Control (16 pins), DSO_CPLD (7 pins), DSO_IO (C23.1), DSO_RAM (5 pins), DSO_Trig (C17#2.1 U5#2.8)
ADC_A0: DSO_Counters (U3#2.15), DSO_RAM (U5#1.16)
ADC_A1: DSO_Counters (U3#2.1), DSO_RAM (U5#1.15)
ADC_A2: DSO_Counters (U3#2.2), DSO_RAM (U5#1.14)
ADC_A3: DSO_Counters (U3#2.3), DSO_RAM (U5#1.13)
ADC_A4: DSO_Counters (U3#2.4), DSO_RAM (U5#1.4)
ADC_A5: DSO_Counters (U3#2.5), DSO_RAM (U5#1.3)
ADC_A6: DSO_Counters (U3#2.6), DSO_RAM (U5#1.2)
ADC_A7: DSO_Counters (U3#2.7), DSO_RAM (U5#1.1)
ADC_A8: DSO_Counters (U4#2.15), DSO_RAM (U5#1.31)
ADC_A9: DSO_Counters (U4#2.1), DSO_RAM (U5#1.30)
ADC_A10: DSO_Counters (U4#2.2), DSO_RAM (U5#1.29)
ADC_A11: DSO_Counters (U4#2.3), DSO_RAM (U5#1.21)
ADC_A12: DSO_Counters (U4#2.4), DSO_RAM (U5#1.20)
ADC_A13: DSO_Counters (U4#2.5), DSO_RAM (U5#1.19)
ADC_A14: DSO_Counters (U4#2.6), DSO_RAM (U5#1.18)
ADC_A15: DSO_Counters (U4#2.7), DSO_RAM (U5#1.17)
ADC_CLK: DSO_ADC (U4#1.10), DSO_CPLD (U12.41), DSO_RAM (TP3.1 U5#1.12)
ADC_D0: DSO_ADC (U3#1.18), DSO_RAM (U5#1.6)
ADC_D1: DSO_ADC (U3#1.17), DSO_RAM (U5#1.7)
ADC_D2: DSO_ADC (U3#1.16), DSO_RAM (U5#1.10)
ADC_D3: DSO_ADC (U3#1.15), DSO_RAM (U5#1.11)
ADC_D4: DSO_ADC (U3#1.14), DSO_RAM (U5#1.22)
ADC_D5: DSO_ADC (U3#1.13), DSO_RAM (U5#1.23)
ADC_D6: DSO_ADC (U3#1.12), DSO_RAM (U5#1.26)
ADC_D7: DSO_ADC (U3#1.11), DSO_RAM (U5#1.27)
CH1_BUF: DSO_ADC (R8.2), DSO_Front (TP1.1)
CH1_NORM: DSO_ADC (C7#1.1 R9.1 TP2.1 U4#1.17), DSO_Trig (U5#2.3)
CLEAR_COUNT: DSO_Counters (U3#2.10 U4#2.10), DSO_CPLD (U12.31)
COUNTER_CLK: DSO_Counters (U3#2.11 U3#2.13 U4#2.13), DSO_CPLD (U12.29)
ENABLE_COUNT: DSO_Counters (U3#2.12 U4#2.12), DSO_CPLD (U12.30)
FAST_CLK: DSO_Clock (U6#1.5), DSO_CPLD (U12.44)
FORCE: DSO_Control (U7.25), DSO_CPLD (U12.2)
FULL: DSO_Counters (U4#2.9), DSO_CPLD (U12.7)
~{RAM_READ}: DSO_CPLD (U12.6), DSO_RAM (U5#1.28)